# EAGLE design six2two-switch3 (EAGLE 6.4)
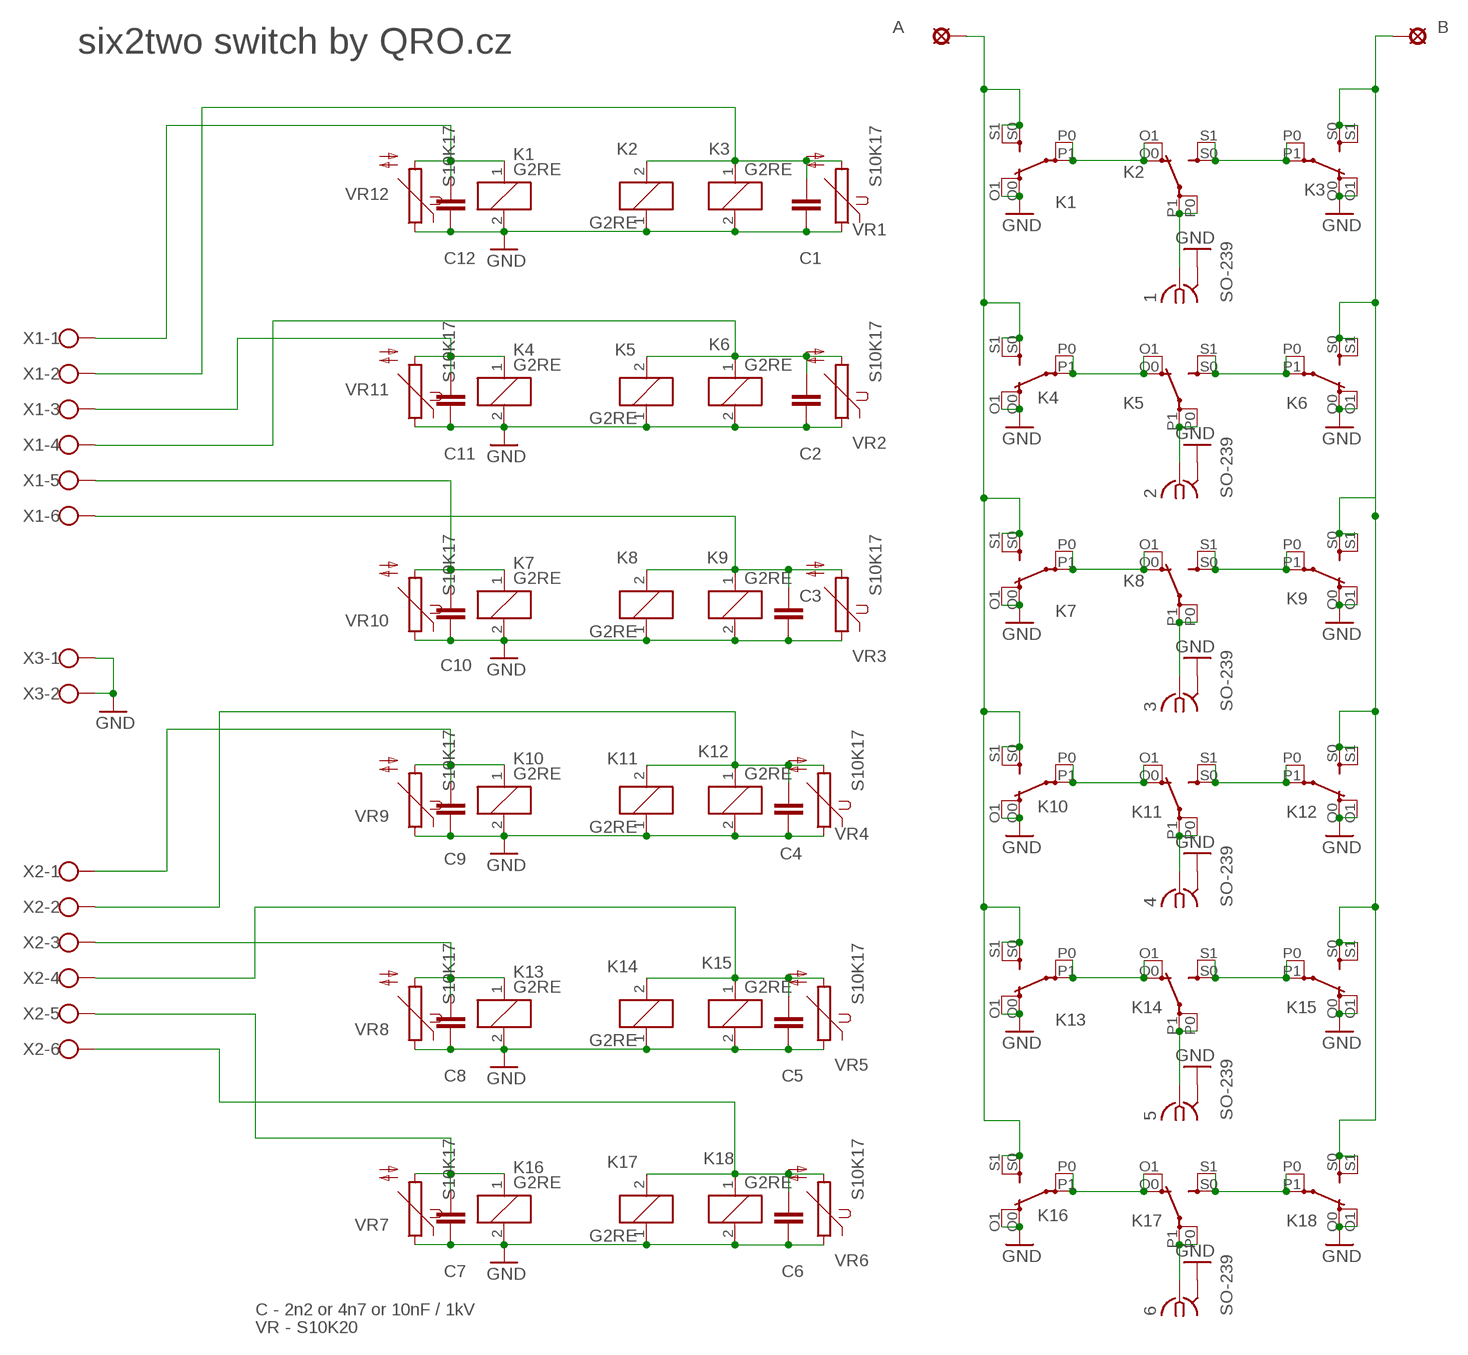
[diagram p0: schematic, sheet 1]

## Parts
1  SO-239  [SO-239]
2  SO-239  [SO-239]
3  SO-239  [SO-239]
4  SO-239  [SO-239]
5  SO-239  [SO-239]
6  SO-239  [SO-239]
A  LSP13  [LSP13]
B  LSP13  [LSP13]
C1  C-EU075-032X103  [C075-032X103]
C2  C-EU075-032X103  [C075-032X103]
C3  C-EU075-032X103  [C075-032X103]
C4  C-EU075-032X103  [C075-032X103]
C5  C-EU075-032X103  [C075-032X103]
C6  C-EU075-032X103  [C075-032X103]
C7  C-EU075-032X103  [C075-032X103]
C8  C-EU075-032X103  [C075-032X103]
C9  C-EU075-032X103  [C075-032X103]
C10  C-EU075-032X103  [C075-032X103]
C11  C-EU075-032X103  [C075-032X103]
C12  C-EU075-032X103  [C075-032X103]
K1  G2RE  [G2RE]
K2  G2RE  [G2RE]
K3  G2RE  [G2RE]
K4  G2RE  [G2RE]
K5  G2RE  [G2RE]
K6  G2RE  [G2RE]
K7  G2RE  [G2RE]
K8  G2RE  [G2RE]
K9  G2RE  [G2RE]
K10  G2RE  [G2RE]
K11  G2RE  [G2RE]
K12  G2RE  [G2RE]
K13  G2RE  [G2RE]
K14  G2RE  [G2RE]
K15  G2RE  [G2RE]
K16  G2RE  [G2RE]
K17  G2RE  [G2RE]
K18  G2RE  [G2RE]
VR1  S10K17  [S10K17]
VR2  S10K17  [S10K17]
VR3  S10K17  [S10K17]
VR4  S10K17  [S10K17]
VR5  S10K17  [S10K17]
VR6  S10K17  [S10K17]
VR7  S10K17  [S10K17]
VR8  S10K17  [S10K17]
VR9  S10K17  [S10K17]
VR10  S10K17  [S10K17]
VR11  S10K17  [S10K17]
VR12  S10K17  [S10K17]
X1  W237-6  [W237-6]
X2  W237-6  [W237-6]
X3  W237-102  [W237-102]

## Nets
GND: 1.P$2(GND) 2.P$2(GND) 3.P$2(GND) 4.P$2(GND) 5.P$2(GND) 6.P$2(GND) C1.2 C2.2 C3.2 C4.2 C5.2 C6.2 C7.2 C8.2 C9.2 C10.2 C11.2 C12.2 K1.2 K1.O0(2:O) K1.O1(2:O) K2.1 K3.2 K3.O0(2:O) K3.O1(2:O) K4.2 K4.O0(2:O) K4.O1(2:O) K5.1 K6.2 K6.O0(2:O) K6.O1(2:O) K7.2 K7.O0(2:O) K7.O1(2:O) K8.1 K9.2 K9.O0(2:O) K9.O1(2:O) K10.2 K10.O0(2:O) K10.O1(2:O) K11.1 K12.2 K12.O0(2:O) K12.O1(2:O) K13.2 K13.O0(2:O) K13.O1(2:O) K14.1 K15.2 K15.O0(2:O) K15.O1(2:O) K16.2 K16.O0(2:O) K16.O1(2:O) K17.1 K18.2 K18.O0(2:O) K18.O1(2:O) VR1.1 VR2.1 VR3.1 VR4.1 VR5.1 VR6.1 VR7.1 VR8.1 VR9.1 VR10.1 VR11.1 VR12.1 X3.1 X3.2
N$1: K1.P0(2:P) K1.P1(2:P) K2.O0(2:O) K2.O1(2:O)
N$2: K7.P0(2:P) K7.P1(2:P) K8.O0(2:O) K8.O1(2:O)
N$3: K2.S0(2:S) K2.S1(2:S) K3.P0(2:P) K3.P1(2:P)
N$4: K4.P0(2:P) K4.P1(2:P) K5.O0(2:O) K5.O1(2:O)
N$5: K5.S0(2:S) K5.S1(2:S) K6.P0(2:P) K6.P1(2:P)
N$6: 1.P$1 K2.P0(2:P) K2.P1(2:P)
N$7: 2.P$1 K5.P0(2:P) K5.P1(2:P)
N$9: K8.S0(2:S) K8.S1(2:S) K9.P0(2:P) K9.P1(2:P)
N$10: K10.P0(2:P) K10.P1(2:P) K11.O0(2:O) K11.O1(2:O)
N$13: K11.S0(2:S) K11.S1(2:S) K12.P0(2:P) K12.P1(2:P)
N$14: 3.P$1 K8.P0(2:P) K8.P1(2:P)
N$15: 4.P$1 K11.P0(2:P) K11.P1(2:P)
N$18: K13.P0(2:P) K13.P1(2:P) K14.O0(2:O) K14.O1(2:O)
N$19: K14.S0(2:S) K14.S1(2:S) K15.P0(2:P) K15.P1(2:P)
N$20: K16.P0(2:P) K16.P1(2:P) K17.O0(2:O) K17.O1(2:O)
N$21: K17.S0(2:S) K17.S1(2:S) K18.P0(2:P) K18.P1(2:P)
N$22: 5.P$1 K14.P0(2:P) K14.P1(2:P)
N$23: 6.P$1 K17.P0(2:P) K17.P1(2:P)
N$24: A.MP K1.S0(2:S) K1.S1(2:S) K4.S0(2:S) K4.S1(2:S) K7.S0(2:S) K7.S1(2:S) K10.S0(2:S) K10.S1(2:S) K13.S0(2:S) K13.S1(2:S) K16.S0(2:S) K16.S1(2:S)
N$26: C1.1 K2.2 K3.1 VR1.2 X1.2
N$27: B.MP K3.S0(2:S) K3.S1(2:S) K6.S0(2:S) K6.S1(2:S) K9.S0(2:S) K9.S1(2:S) K12.S0(2:S) K12.S1(2:S) K15.S0(2:S) K15.S1(2:S) K18.S0(2:S) K18.S1(2:S)
N$28: C2.1 K5.2 K6.1 VR2.2 X1.4
N$29: C3.1 K8.2 K9.1 VR3.2 X1.6
N$30: C4.1 K11.2 K12.1 VR4.2 X2.2
N$31: C5.1 K14.2 K15.1 VR5.2 X2.4
N$32: C6.1 K17.2 K18.1 VR6.2 X2.6
N$34: C12.1 K1.1 VR12.2 X1.1
N$35: C10.1 K7.1 VR10.2 X1.5
N$36: C11.1 K4.1 VR11.2 X1.3
N$37: C9.1 K10.1 VR9.2 X2.1
N$39: C8.1 K13.1 VR8.2 X2.3
N$41: C7.1 K16.1 VR7.2 X2.5

## Notes on the sheet
- six2two switch by QRO.cz
- C - 2n2 or 4n7 or 10nF / 1kV
- VR - S10K20

## Library data of the parts
1-6 = con-coax-pl:SO-239
A B = solpad_2:LSP13: SOLDER PAD drill 1.3 mm, distributor Buerklin, 12H562
C1-C12 = rcl2:C-EU: CAPACITOR, European symbol
K1-K18 = relay:G2RE: RELAY 1 x switch, high current, Omron; OC_FARNELL: unknown; OC_NEWARK: unknown
VR1-VR12 = varistor:S10K17: VARISTOR
X1 X2 = con-wago-500:W237-6: WAGO SCREW CLAMP; OC_FARNELL: unknown; OC_NEWARK: unknown
X3 = con-wago-500:W237-102: WAGO SCREW CLAMP; MPN: 237-102; OC_FARNELL: unknown; OC_NEWARK: 70K9898

## Board
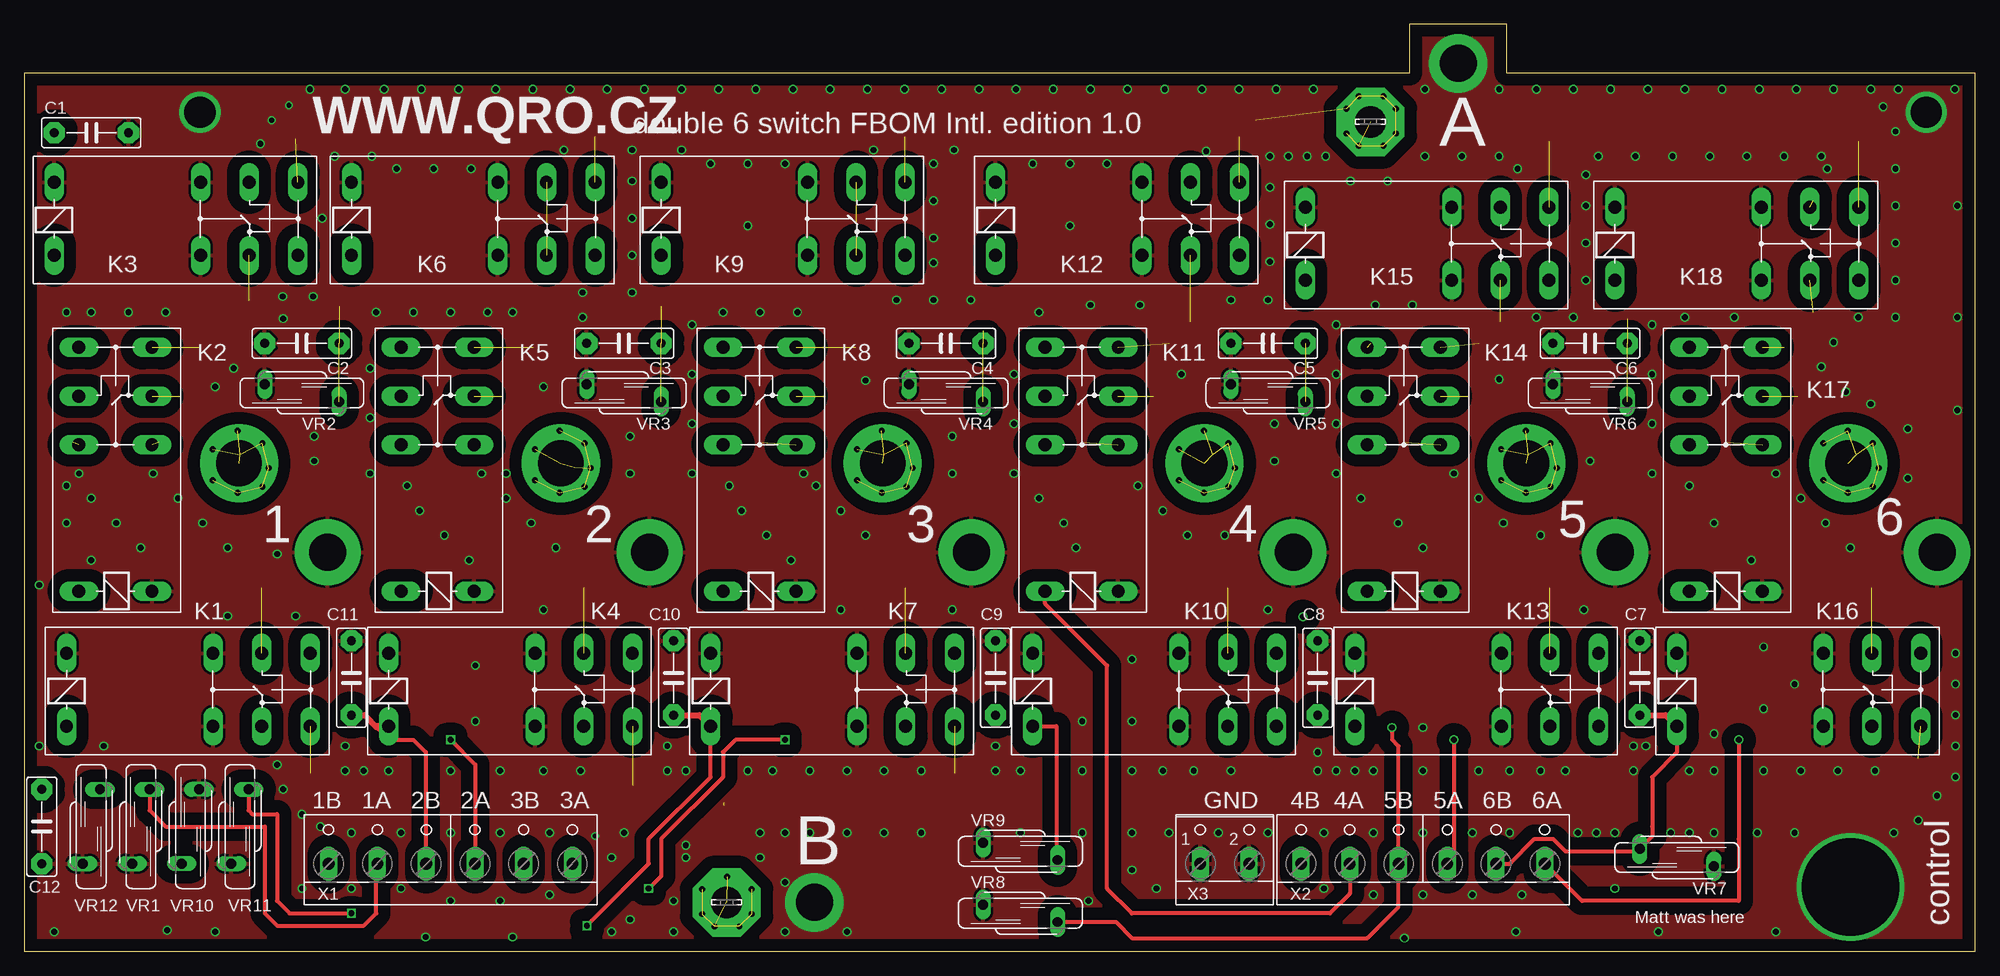
[diagram p1: board, top side]
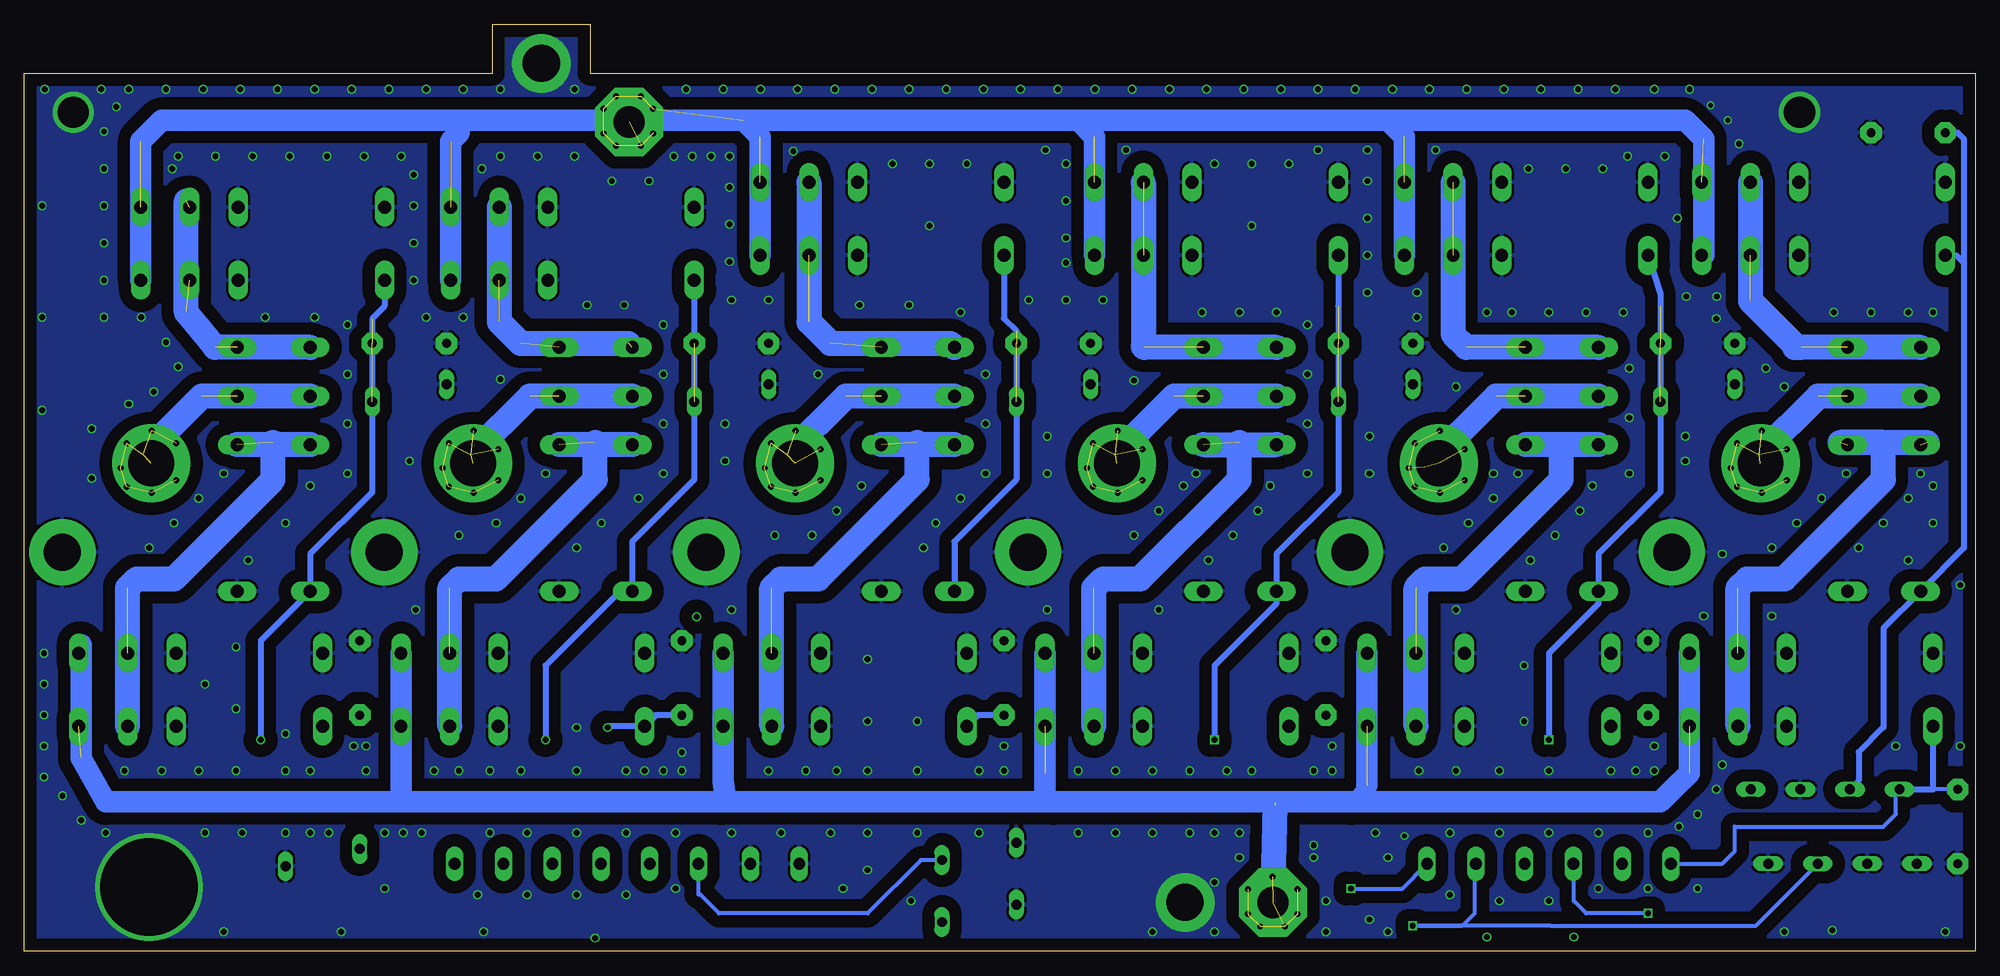
[diagram p2: board, bottom side, seen from below]

Size 200 x 95 mm. Coordinates in mm from the lower left corner, seen from the top.
Outline: 0,0 200,0 200,90 152,90 152,95 142,95 142,90 0,90 0,0
Copper layers (1*16): Top 0.035mm / dielectric 1.5mm / Bottom 0.035mm
Design rules "hackvana": minimum track width 6mil, minimum drill 0.3mm, track to track 6mil, track to pad 6mil, pad to pad 6mil, via to via 6mil, smd to smd 0mil, copper to edge 6mil, drill to drill 6mil, minimum pad ring 10mil, minimum via ring 6mil, stop-mask expansion 2mil, vias tented up to drill 100mil, thermal gap 10mil

### Footprints (pad centres in the part's own frame; a part is rotated, then mirrored left to right if it is on the bottom)
SO-239 = drill 4.7 pad 8: P$1 0,0 | drill 3.8 pad 6.8: P$2 -9.1,9.1
LSP13 = drill 3.2 pad 7 octagon: MP 0,0
C075-032X103 = drill 0.914 pad 2.184 octagon: 1 -3.81,0; 2 3.81,0
G2RE = drill 1.321 long: 1 -2.54,-3.683; 2 -2.54,3.81; O0 12.471,-3.683; O1 12.471,3.81; P0 17.45,-3.683; P1 17.45,3.81; S0 22.454,-3.683; S1 22.454,3.81
S10K17 = drill 1.016 long: 1 -0.889,-3.81; 2 0.889,3.81
W237-6 = drill 1.194 long: 1 -12.5,-1.27; 2 -7.5,-1.27; 3 -2.5,-1.27; 4 2.5,-1.27; 5 7.5,-1.27; 6 12.5,-1.27
W237-102 = drill 1.194 long: 1 -2.5,-1.27; 2 2.5,-1.27

### Placement (x,y rotation side)
1  22,50 180 top
2  55,50 180 top
3  88,50 180 top
4  121,50 180 top
5  154,50 180 top
6  187,50 180 top
A  72,5 0 top
B  138,85 0 top
C1  6.86,83.9 0 top
C2  28.45,62.31 180 top
C3  61.47,62.31 180 top
C4  94.49,62.31 180 top
C5  127.51,62.31 180 top
C6  160.53,62.31 180 top
C7  165.61,28.02 90 top
C8  132.59,28.02 90 top
C9  99.57,28.02 90 top
C10  66.55,28.02 90 top
C11  33.53,28.02 90 top
C12  1.78,12.78 270 top
K1  6.86,26.75 0 top
K2  9.4,39.45 90 top
K3  5.59,75.01 0 top
K4  39.88,26.75 0 top
K5  42.42,39.45 90 top
K6  36.07,75.01 0 top
K7  72.9,26.75 0 top
K8  75.44,39.45 90 top
K9  67.82,75.01 0 top
K10  105.92,26.75 0 top
K11  108.46,39.45 90 top
K12  102.11,75.01 0 top
K13  138.94,26.75 0 top
K14  141.48,39.45 90 top
K15  133.86,72.47 0 top
K16  171.96,26.75 0 top
K17  174.5,39.45 90 top
K18  165.61,72.47 0 top
VR1  11.94,12.78 0 top
VR2  28.45,57.23 270 top
VR3  61.47,57.23 270 top
VR4  94.49,57.23 270 top
VR5  127.51,57.23 270 top
VR6  160.53,57.23 270 top
VR7  169.42,9.6 90 top
VR8  102.11,3.89 270 top
VR9  102.11,10.24 270 top
VR10  17.02,12.78 180 top
VR11  22.1,12.78 0 top
VR12  6.86,12.78 0 top
X1  43.69,10.24 0 top
X2  143.39,10.24 0 top
X3  123.07,10.24 0 top

### Tracks (layer width: path | path; a pad name or v marks a point on that pad's centre or on a via)
GND  (via drill 0.5, 0.6, 10, 3.2, 3.8 pad 6)
  other vias: 37.34,18.49 33.53,12.14 28.45,14.05 32.9,21.03 25.91,19.13 27.82,34.37 43.69,18.49 48.77,18.49 53.22,18.49 57.03,18.49 46.23,23.57 46.23,29.29 65.92,18.49 67.82,18.49 65.92,21.03 74.17,18.49 76.71,18.49 80.52,18.49 84.33,18.49 91.95,18.49 88.14,18.49 38.61,12.14 43.69,12.14 48.77,12.14 53.85,12.14 60.2,9.6 53.85,5.79 50.04,1.46 67.82,10.87 61.47,12.14 75.44,12.14 80.52,12.14 84.33,12.14 88.14,12.14 91.95,12.14 102.11,12.14 108.46,12.14 168.79,12.14 167.52,1.98 179.58,1.98 127.51,12.14 141.48,1.35 133.23,12.14 138.31,12.14 99.57,18.49 102.11,18.49 113.54,18.49 116.72,18.49 119.89,18.49 123.7,18.49 132.59,18.49 136.4,18.49 138.31,18.49 163.07,12.14 173.23,12.14 159.26,12.14 1.51,37.54 1.51,21.03 19.56,1.98 3.05,1.98 25.91,40.72 20.83,41.35 18.29,43.89 15.75,46.43 13.21,48.97 5.59,48.97 6.86,46.43 9.4,43.89 11.94,41.35 4.32,43.89 4.32,65.48 6.86,65.48 10.67,65.48 14.48,65.48 19.56,57.86 29.72,50.24 36.07,65.48 35.44,59.77 35.44,54.69 35.44,48.97 39.25,47.7 40.52,45.16 43.06,42.62 45.6,40.08 53.22,35 46.87,48.97 49.41,48.97 49.41,46.43 51.95,43.89 54.49,41.35 62.11,52.78 68.46,59.13 68.46,64.21 68.46,54.05 68.46,48.97 72.27,47.7 73.54,45.16 76.08,42.62 78.62,40.08 83.7,35 79.89,48.97 81.16,47.7 83.7,45.16 86.24,42.62 95.13,35 104.02,65.48 101.48,59.13 101.48,54.05 101.48,48.97 104.02,46.43 106.56,43.89 107.83,41.35 114.18,47.7 116.72,45.16 119.26,42.62 123.07,42.62 128.15,50.24 134.5,64.21 134.5,59.13 134.5,54.05 134.5,48.97 137.04,46.43 140.85,43.89 143.39,41.35 146.56,48.97 149.1,46.43 151.64,43.89 155.45,42.62 160.53,50.24 166.88,64.21 166.88,59.13 166.88,54.05 166.88,48.97 170.69,47.7 173.23,43.89 177.04,40.08 179.58,48.97 182.12,46.43 184.66,43.89 187.2,41.35 198,17.86 198,24.21 198,30.56 163.07,6.43 153.55,5.79 148.47,5.79 143.39,5.79 143.39,12.14 143.39,18.49 148.47,12.14 177.68,12.14 164.98,18.49 166.25,21.03 170.69,18.49 173.23,18.49 173.23,22.3 164.98,21.03 157.99,18.49 155.45,18.49 149.1,18.49 109.1,5.16 152.28,12.14 178.31,18.49 182.12,18.49 185.93,18.49 189.74,18.49 181.49,27.38 159.9,35 113.54,12.14 143.39,22.94 133.23,6.43 138.31,5.79 113.54,8.33 113.54,23.57 152.91,1.98 84.33,1.98 77.98,1.98 27.12,86.71 58.52,11.81 187.24,6.58 108.46,18.49 108.46,23.57 28.45,6.43 14.64,2.16 33.53,6.43 38.61,6.43 43.69,5.16 48.77,5.16 26.5,67.11 29.61,67.11 29.28,88.35 32.9,88.34 36.9,88.35 40.71,88.35 44.52,88.35 48.33,88.35 52.14,88.35 55.95,88.35 59.76,88.35 63.57,88.35 67.38,88.35 71.19,88.35 75,88.35 78.81,88.35 82.62,88.35 86.43,88.35 90.24,88.35 30.55,75.13 57.22,67.51 62.3,67.51 62.3,71.32 62.3,75.13 62.3,78.94 38.17,80.21 41.98,80.21 45.79,80.21 24.2,82.75 39.88,65.48 43.69,65.48 47.5,65.48 71.63,65.48 75.44,65.48 79.25,65.48 89.41,66.75 70.36,80.72 74.17,80.72 77.98,80.72 94.05,88.35 97.86,88.35 101.67,88.35 105.48,88.35 109.29,88.35 113.1,88.35 116.91,88.35 120.72,88.35 124.53,88.35 128.34,88.35 132.15,88.35 143.58,88.35 151.2,88.35 155.01,88.35 158.82,88.35 93.22,66.75 97.03,66.75 93.22,70.56 93.22,73.1 93.22,76.91 93.22,80.72 103.38,80.72 107.19,80.72 111,80.72 123.7,66.75 127.51,66.75 118.62,59.13 86.24,58.5 162.63,88.35 166.44,88.35 170.25,88.35 174.06,88.35 177.87,88.35 181.68,88.35 185.49,88.35 189.3,88.35 192.11,88.35 197.92,88.35 190.57,86.56 191.84,84.02 191.84,80.21 191.84,76.4 191.84,72.59 191.84,68.78 191.84,64.97 188.03,64.97 185.49,62.43 184.22,59.89 186.76,57.35 189.3,56.08 193.11,53.54 198.19,76.4 198.19,64.97 198.19,55.45 184.22,81.48 180.41,81.48 176.6,81.48 172.79,81.48 168.98,81.48 165.17,81.48 161.36,81.48 160.09,72.59 160.09,68.78 151.2,58.62 155.01,64.97 158.82,64.97 138.5,66.24 142.31,66.24 170.25,64.97 175.33,64.97 151.2,81.48 147.39,81.48 143.58,81.48 133.42,81.48 129.61,81.48 127.7,70.69 114.37,66.24 109.29,66.24 113.54,29.92 127.51,35 34.8,18.49 8.13,21.03 53.22,57.86 62.11,48.97 95.13,48.97 95.13,52.78 128.15,54.05 193.11,48.46 4.32,47.7 6.86,40.08 67.82,9.6 75.44,9.6 66.55,1.98 60.2,1.98 41.15,1.46 77.98,7.06 77.98,12.14 135.96,78.94 139.77,78.94 117.35,12.14 18,86 195,86 31.82,81.48 35.63,81.48 55.31,82.12 62.3,82.12 67.38,82.12 87.06,82.12 95.32,82.12 121.16,81.99 131.51,81.48 127.7,81.48 127.7,78.31 127.7,74.5 153.1,80.21 160.09,79.58 160.09,76.4 184.85,80.21 181.49,12.14 191.65,12.14 194.19,13.41 196.09,15.95 198,21.03 198,27.38 178.31,31.19 178.31,24.84 161.17,12.14 170.69,12.14 152.28,18.49 134.5,18.49 132.59,20.4 122.43,12.14 116.08,6.43 99.57,21.03 62.11,3.25 66.55,5.16 26.55,16.59 30.36,12.78 32.9,18.49 20.83,34.37 21.47,59.77 26.55,64.85 29.72,52.78 50.04,65.48 57.22,64.97 25.35,85.17 74.17,74.37 107.19,74.37 81,5 147,91
  pour Bottom (isolate 1.27): 0,0 200,0 200,90 152,90 152,95 142,95 142,90 0,90
  pour Top (isolate 1.27): 0,90 0,0 200,0 200,90 152,90 152,95 142,95 142,90
N$1  (3 unrouted)
  Bottom 2.54: K1.P0 24.31,37.24 23.37,38.18 19.56,38.18 9.4,48.34 9.4,52.15 13.85,52.15 4.96,52.15
N$2  (2 unrouted)
  Bottom 2.54: K7.P0 90.35,37.24 89.41,38.18 85.6,38.18 75.44,48.34 75.44,52.15 | K8.O0 K8.O1
N$3  (2 unrouted)
  Bottom 2.54: K2.S1 17.89,61.9 18.29,61.9 | 18.29,61.9 18.52,61.9 | K3.P1 23.04,66.65 18.29,61.9
N$4  (1 unrouted)
  Bottom 2.54: K5.O1 42.42,51.92 | 42.42,51.92 K5.O0 | K4.P0 57.33,37.24 56.39,38.18 52.58,38.18 42.42,48.34 42.42,51.92
N$5  (2 unrouted)
  Bottom 2.54: K5.S1 52.17,61.9 53.52,63.25 K6.P1
N$6  (via drill 0.6)  (9 unrouted)
  Bottom 2.54: K2.P1 16.08,56.9 22.1,50.88
  other vias: 19.32,51.44 21.86,53.34 24.4,52.07 25.04,49.53 24.4,47.62 21.86,46.99 19.32,48.26
N$7  (via drill 0.6)  (9 unrouted)
  Bottom 2.54: K5.P1 49.1,56.9 56.39,49.61
  other vias: 57.42,47.62 54.88,46.99 52.34,48.26 52.34,51.44 54.88,53.34 57.42,52.07 58.05,49.53
N$9  (2 unrouted)
  Bottom 2.54: K8.S1 85.19,61.9 85.27,61.98 K9.P1
N$10  (2 unrouted)
  Bottom 2.54: K10.P0 123.37,37.24 122.43,38.18 118.62,38.18 108.46,48.34 108.46,52.15 | K11.O1 K11.O0
N$13  (2 unrouted)
  Bottom 2.54: K12.P1 119.56,64.52 117.35,62.31 105.06,62.31 K11.S1
N$14  (via drill 0.6)  (9 unrouted)
  Bottom 2.54: K8.P1 82.12,56.9 88.14,50.88
  other vias: 85.36,51.44 87.9,53.34 90.44,52.07 91.08,49.53 90.44,47.62 87.9,46.99 85.36,48.26
N$15  (via drill 0.6)  (9 unrouted)
  Bottom 2.54: K11.P1 115.78,56.9 121.8,50.88
  other vias: 118.38,48.26 118.38,51.44 120.92,46.99 123.46,47.62 124.09,49.53 123.46,52.07 120.92,53.34
N$18  (2 unrouted)
  Bottom 2.54: K13.P0 156.39,37.24 155.45,38.18 151.64,38.18 141.48,48.34 141.48,52.15 | K14.O1 K14.O0
N$19  (3 unrouted)
  Bottom 2.54: K15.P1 151.31,64.52 149.1,62.31 138.08,62.31
N$20  (2 unrouted)
  Bottom 2.54: K16.P0 189.41,37.24 188.47,38.18 184.66,38.18 174.5,48.34 174.5,52.15 | K17.O1 K17.O0
N$21  (3 unrouted)
  Bottom 2.54: K17.S1 180.44,61.9 183.39,65.48 183.39,76.91
N$22  (via drill 0.6)  (9 unrouted)
  Bottom 2.54: K14.P1 148.16,56.9 154.18,50.88
  other vias: 151.4,51.44 153.94,53.34 156.48,52.07 157.12,49.53 156.48,47.62 153.94,46.99 151.4,48.26
N$23  (via drill 0.6)  (9 unrouted)
  Bottom 2.54: K17.P1 181.82,56.9 187.84,50.88
  other vias: 184.42,52.07 186.96,53.34 189.5,52.07 190.13,49.53 189.5,47.62 186.96,46.99 184.42,48.26
N$24  (via drill 0.6)  (12 unrouted)
  Bottom 0.406: 128.38,17.45 128.54,17.45 128.54,15.32 | K10.S0 128.54,23.06 128.54,17.78 128.38,17.78 | K13.S0 161.4,16.51
  Bottom 1.27: 62.34,16.99 64.01,15.32 | 95.36,16.18 94.49,15.32 | 161.4,16.18 160.53,15.32
  Bottom 1.422: 71.74,15.21 71.63,15.32 | 71.75,14.96 71.39,15.32
  Bottom 1.93: 194.19,31.42 K16.S1
  Bottom 2.184: K7.S1 95.36,18.26 95.36,16.18 | K10.S1 K10.S0 128.38,17.78 128.38,17.45 128.15,15.95 | K1.S1 29.32,18.26 30.99,16.59 32.26,15.32 64.01,15.32 71.39,15.32 | 71.63,15.32 94.49,15.32 128.54,15.32 160.53,15.32 191.65,15.32 194.19,19.76 194.19,31.42 | K4.S1 62.34,16.99 | K13.S1 K13.S0 161.4,16.51 161.4,16.18
  Bottom 2.54: A.MP 71.75,14.96
  other vias: 69.48,6.35 72.03,7.62 74.56,6.35 74.56,3.81 73.3,2.54 70.75,2.54 69.48,3.81
N$26
  Top 0.406: VR1.2 12.83,14.43 14.48,12.78 24.64,12.78 24.64,3.89 25.91,2.62 34.8,2.62 36.07,3.89 36.07,8.85 X1.2
  Bottom 0.61: K3.1 1.91,71.32 1.15,70.56 | 1.15,70.56 1.15,41.35 K2.2 9.4,33.1 9.4,22.94 11.94,20.4 11.94,17.48 VR1.2 | C1.1 1.78,83.9 1.15,83.26 1.15,70.56
N$27  (via drill 0.6)  (15 unrouted)
  Bottom 1.27: K3.S0 27.82,71.32 | 155.45,83.9 154.18,85.17
  Bottom 2.184: 27.82,71.32 27.82,83.26 29.72,85.17 60.2,85.17 | 60.2,85.17 91.95,85.17 | 91.95,85.17 126.24,85.17 | 126.24,85.17 154.18,85.17 185.93,85.17 187.84,83.26 188.06,83.03 K18.S0 | K6.S0 58.52,83.49 60.2,85.17 | K9.S0 90.28,83.49 91.95,85.17 | K12.S0 124.56,83.49 126.24,85.17 | K15.S0 156.31,83.03 155.45,83.9
  other vias: 135.53,86.36 136.79,87.63 139.34,87.63 140.6,86.36 140.6,83.82 139.34,82.55 136.79,82.55 135.53,83.82
N$28  (via drill 0.6)  (2 unrouted)
  Top 0.406: v43.69,21.67 46.23,19.13 46.23,9.01 X1.4
  Bottom 0.61: K6.1 32.26,67.39 32.26,66.12 32.26,47.07 38.61,40.72 K5.2 38.61,35.64 43.69,30.56 v43.69,21.67
N$29  (via drill 0.6)  (2 unrouted)
  Top 0.406: v77.98,21.67 72.9,21.67 71.63,20.4 71.63,17.86 65.28,11.51 65.28,7.7 v64.01,6.43
  Bottom 0.406: v64.01,6.43 58.73,6.43 X1.6
  Bottom 0.61: K9.1 65.28,69.93 65.28,66.12 65.28,47.07 71.63,40.72 K8.2 71.63,35.64 77.98,29.29 v77.98,21.67
N$30  (2 unrouted)
  Top 0.406: X2.2 135.89,5.91 133.86,3.89 113.54,3.89 111,6.43 111,29.29 104.65,35.64 K11.2
  Bottom 0.61: K11.2 104.65,41.99 98.3,48.34 98.3,63.58 99.57,64.85 K12.1
N$31  (via drill 0.6)  (1 unrouted)
  Top 0.406: v146.56,21.67 146.56,9.64 X2.4
  Bottom 0.61: 131.32,63.58 C5.1 | C5.1 131.32,48.34 137.67,41.99 137.67,38.18 K14.2 138.94,36.91 146.56,29.29 v146.56,21.67 | K15.1 C5.1
N$32  (via drill 0.6)  (2 unrouted)
  Top 0.406: v175.77,21.67 175.77,11.51 175.77,5.16 159.7,5.16 X2.6
  Bottom 0.61: v175.77,21.67 175.77,31.83 K17.2 170.69,40.72 164.34,47.07 164.34,64.85 163.07,66.12 K18.1
N$34
  Bottom 0.406: X1.1 25.91,8.97 24.64,10.24 24.64,12.78 9.4,12.78 8.13,14.05 8.13,16.2 VR12.2 | C12.1 4.32,16.59
  Bottom 0.61: VR12.2 4.32,16.59 K1.1
N$35  (via drill 0.6)
  Top 0.406: v57.66,2.62 64.01,8.97 64.01,11.51 70.36,17.86 K7.1
  Top 0.61: C10.1 69.22,24.21 K7.1
  Bottom 0.406: VR10.2 22.48,2.62 43.57,2.62 v57.66,2.62 52.58,2.62 51.31,3.89 51.31,8.85 X1.5
N$36  (via drill 0.6)
  Top 0.406: 36.19,22.93 37.34,21.67 39.88,21.67 41.15,20.4 41.15,9.01 X1.3 | VR11.2 22.99,14.43 23.37,14.05 25.91,14.05 25.91,5.16 27.18,3.89 v33.53,3.89
  Top 0.61: K4.1 36.2,23.06 36.19,22.93 34.92,24.21 C11.1
  Bottom 0.406: v33.53,3.89 39.88,3.89 41.15,5.16 41.15,8.93 X1.3
N$37
  Top 0.406: K10.1 105.79,23.06 105.79,9.09 105.92,8.97 VR9.2 | 130.69,8.77 X2.1
  Bottom 0.406: VR9.2 108.08,9.35 113.54,3.89 128.78,3.89 130.69,5.79 130.89,5.79 X2.1
  Bottom 0.61: C9.1 102.24,24.21 K10.1
N$39  (via drill 0.6)
  Top 0.406: v140.21,22.94 140.21,21.71 140.89,21.03 X2.3 140.85,8.93 140.85,4.52 137.67,1.35 113.54,1.35 111.89,3 VR8.2
  Bottom 0.61: C8.1 135.26,24.21 K13.1 140.08,23.06 v140.21,22.94
N$41
  Top 0.406: X2.5 152.28,8.97 154.82,11.51 156.72,11.51 157.99,10.24 165.36,10.24 VR7.2 166.88,11.76 166.88,12.78 166.88,17.86 169.42,20.4 K16.1
  Top 0.61: C7.1 168.28,24.21 K16.1
N$83  (via drill 0.6)
  other vias: 131.08,34.29

### Text on the board
tNames: WWW.QRO.CZ | double 6 switch FBOM Intl. edition 1.0 | A | 6 | 1 | 2 | 3 | 4 | 5 | 1B | 1A | 2B | 2A | 3B | 3A | GND | 4B | 4A | 5B | 5A | 6B | 6A | B | Matt was here | control
201bmp: /home/ondra/downloads/logo.bmp